# Altium schematic sheet STM32.SchDoc: STM32
size A3; DocumentNumber: 11; Revision: 2.0; SheetNumber: 11; SheetTotal: 18
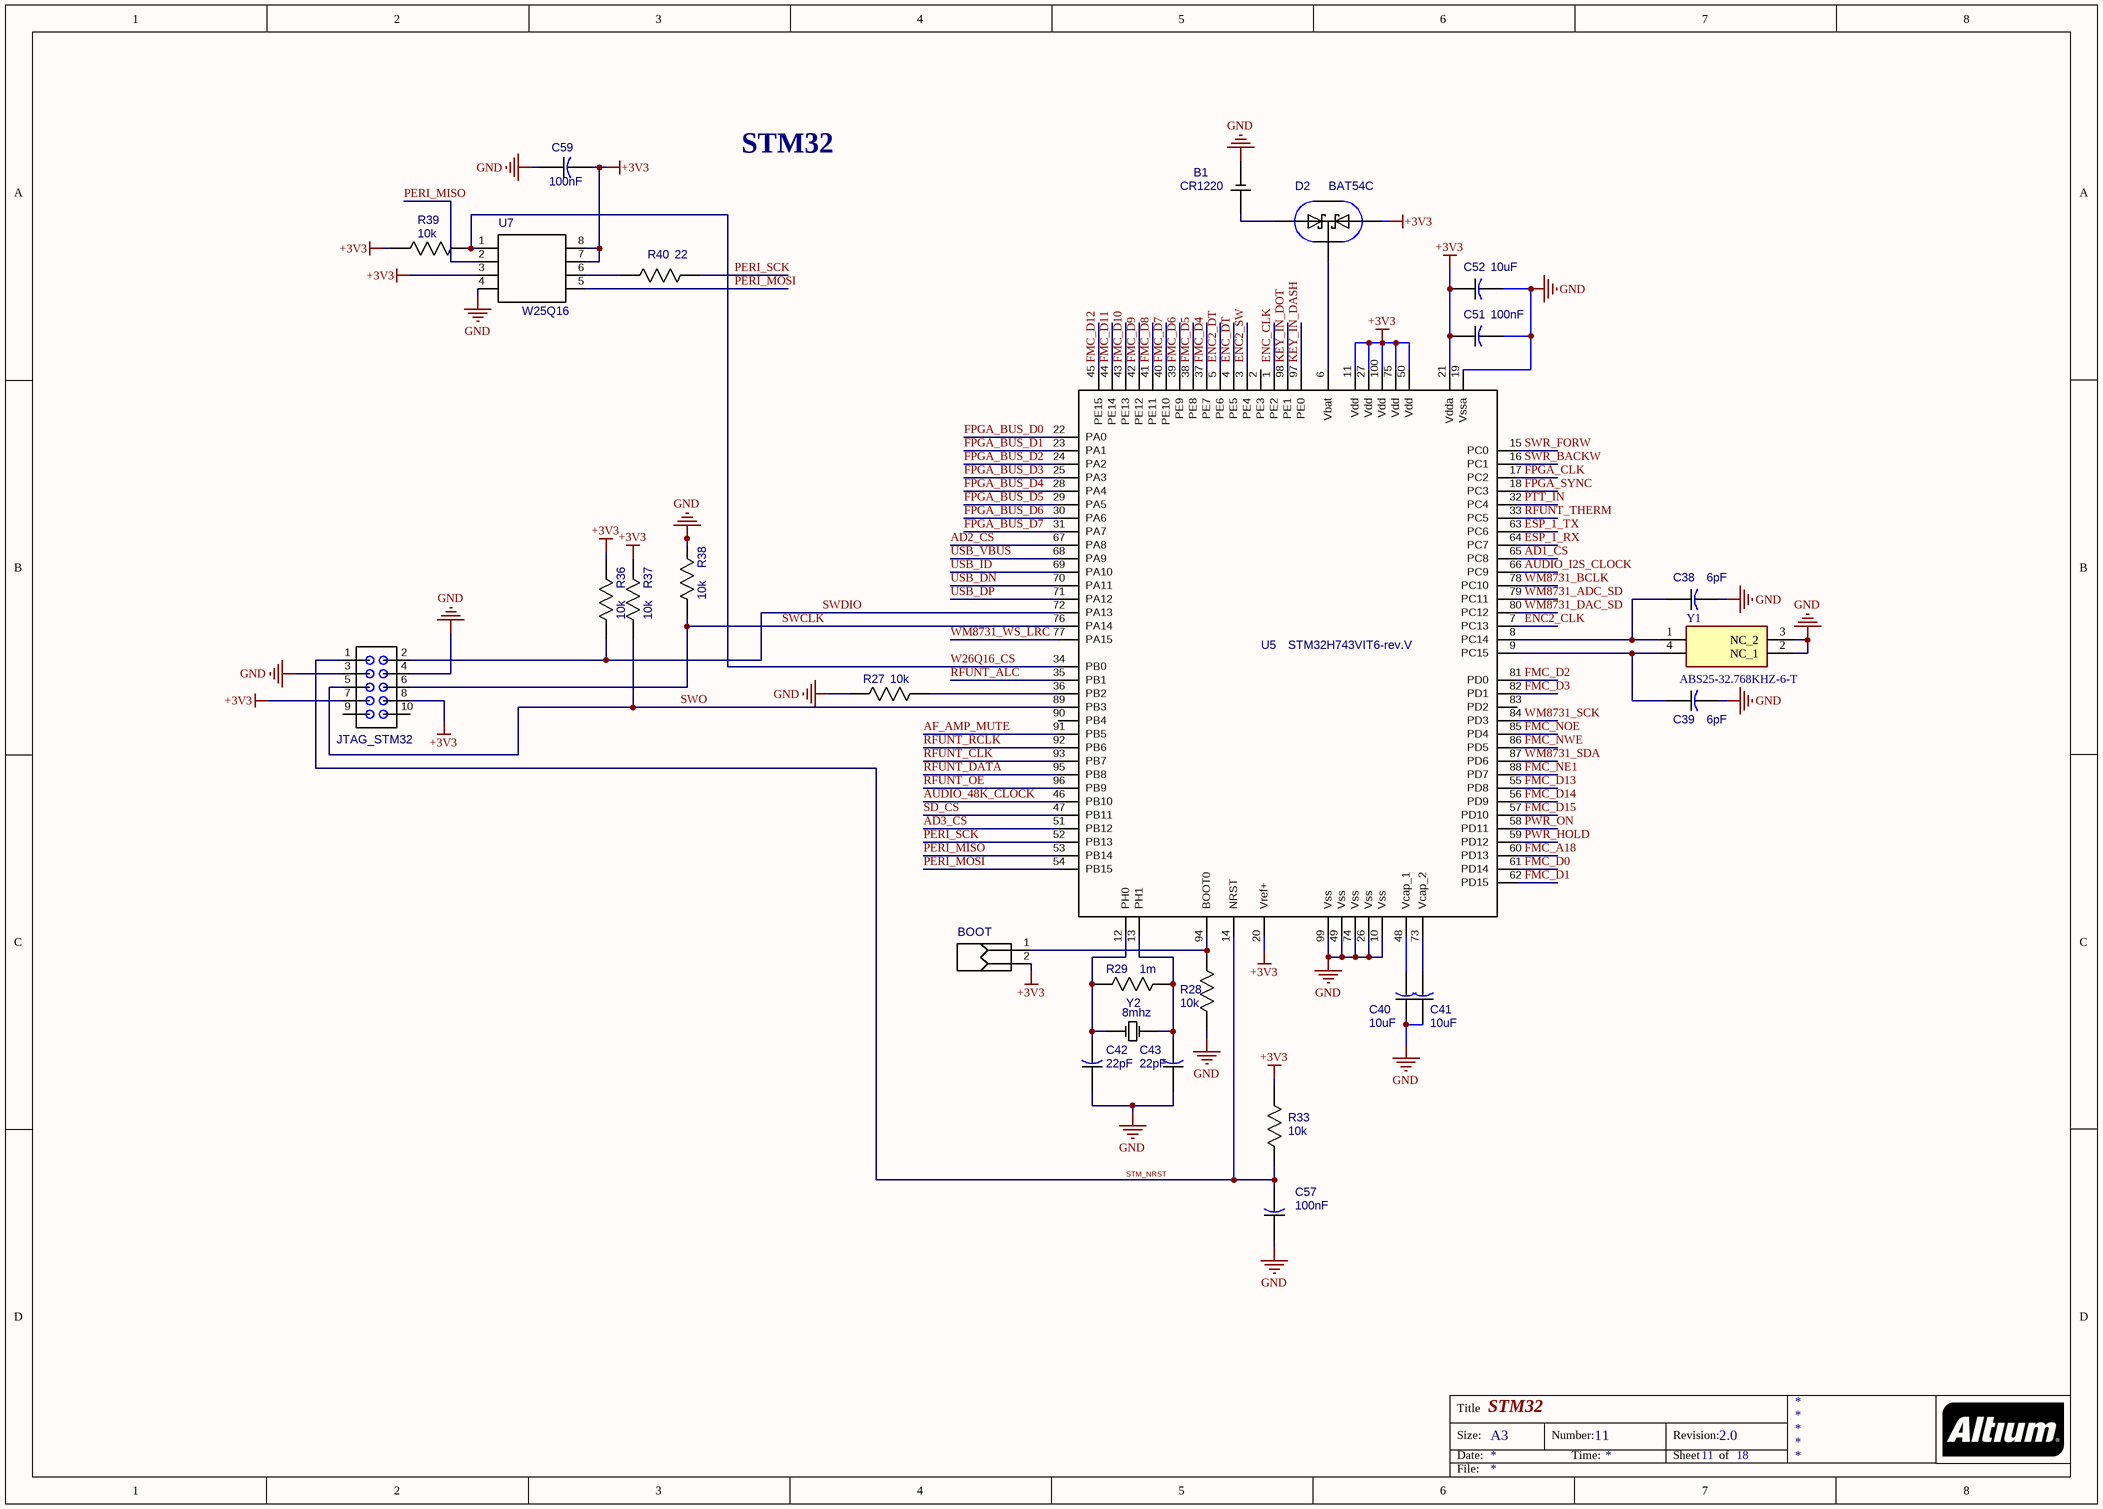
[diagram p0: STM32.SchDoc]

## Parts
B1  CR1220  [KLS5-CR1220-01]
BOOT  (no value)  [51022-0200]
C38  6pF  [CAP_0805]
C39  6pF  [CAP_0805]
C40  10uF  [CAP_0805]
C41  10uF  [CAP_0805]
C42  22pF  [CAP_0805]
C43  22pF  [CAP_0805]
C51  100nF  [CAP_0805]
C52  10uF  [CAP_0805]
C57  100nF  [CAP_0805]
C59  100nF  [CAP_0805]
D2  BAT54C  [BAT54C]
JTAG_STM32  (no value)  [IDC10]
R27  10k  [RES_0805]
R28  10k  [RES_0805]
R29  1m  [RES_0805]
R33  10k  [RES_0805]
R36  10k  [RES_0805]
R37  10k  [RES_0805]
R38  10k  [RES_0805]
R39  10k  [RES_0805]
R40  22  [RES_0805]
U5  STM32H743VIT6-rev.V  [STM32H743VIT6]
U7  W25Q16  [W25Q16]
Y1  ABS25-32.768KHZ-6-T  [ABS25]
Y2  8mhz  [ECS-200-20-1]

## Nets
+3V3: BOOT.2 C51.1 C52.1 C59.2 D2.1((A1)) JTAG_STM32.7 JTAG_STM32.8 R33.2 R36.1 R37.1 R39.1 U5.11(Vdd) U5.20(Vref+) U5.21(Vdda) U5.27(Vdd) U5.50(Vdd) U5.75(Vdd) U5.100(Vdd) U7.3(WP) U7.7(HOLD) U7.8(VCC)
GND: B1.2(NEG) C38.2 C39.2 C40.1 C41.1 C42.1 C43.1 C51.2 C52.2 C57.1 C59.1 JTAG_STM32.3 JTAG_STM32.4 R27.1 R28.1 R38.1 U5.10(Vss) U5.19(Vssa) U5.26(Vss) U5.49(Vss) U5.74(Vss) U5.99(Vss) U7.4(GND) Y1.2(NC_1) Y1.3(NC_2)
AD1_CS: U5.65(PC8)
AD2_CS: U5.67(PA8)
AD3_CS: U5.51(PB12)
AF_AMP_MUTE: U5.91(PB5)
AUDIO_48K_CLOCK: U5.46(PB10)
AUDIO_I2S_CLOCK: U5.66(PC9)
ENC2_CLK: U5.7(PC13)
ENC2_DT: U5.5(PE6)
ENC2_SW: U5.3(PE4)
ENC_CLK: U5.1(PE2)
ENC_DT: U5.4(PE5)
ESP_1_RX: U5.64(PC7)
ESP_1_TX: U5.63(PC6)
FMC_A18: U5.60(PD13)
FMC_D0: U5.61(PD14)
FMC_D1: U5.62(PD15)
FMC_D2: U5.81(PD0)
FMC_D3: U5.82(PD1)
FMC_D4: U5.37(PE7)
FMC_D5: U5.38(PE8)
FMC_D6: U5.39(PE9)
FMC_D7: U5.40(PE10)
FMC_D8: U5.41(PE11)
FMC_D9: U5.42(PE12)
FMC_D10: U5.43(PE13)
FMC_D11: U5.44(PE14)
FMC_D12: U5.45(PE15)
FMC_D13: U5.55(PD8)
FMC_D14: U5.56(PD9)
FMC_D15: U5.57(PD10)
FMC_NE1: U5.88(PD7)
FMC_NOE: U5.85(PD4)
FMC_NWE: U5.86(PD5)
FPGA_BUS_D0: U5.22(PA0)
FPGA_BUS_D1: U5.23(PA1)
FPGA_BUS_D2: U5.24(PA2)
FPGA_BUS_D3: U5.25(PA3)
FPGA_BUS_D4: U5.28(PA4)
FPGA_BUS_D5: U5.29(PA5)
FPGA_BUS_D6: U5.30(PA6)
FPGA_BUS_D7: U5.31(PA7)
FPGA_CLK: U5.17(PC2)
FPGA_SYNC: U5.18(PC3)
KEY_IN_DASH: U5.97(PE0)
KEY_IN_DOT: U5.98(PE1)
PERI_MISO: U5.53(PB14) U7.2(SO)
PERI_MOSI: U5.54(PB15) U7.5(SI)
PERI_SCK: R40.2 U5.52(PB13)
PTT_IN: U5.32(PC4)
PWR_HOLD: U5.59(PD12)
PWR_ON: U5.58(PD11)
RFUNT_ALC: U5.35(PB1)
RFUNT_CLK: U5.93(PB7)
RFUNT_DATA: U5.95(PB8)
RFUNT_OE: U5.96(PB9)
RFUNT_RCLK: U5.92(PB6)
RFUNT_THERM: U5.33(PC5)
SD_CS: U5.47(PB11)
STM_NRST: C57.2 JTAG_STM32.1 R33.1 U5.14(NRST)
SWCLK: JTAG_STM32.6 R38.2 U5.76(PA14)
SWDIO: JTAG_STM32.2 R36.2 U5.72(PA13)
SWO: JTAG_STM32.5 R37.2 U5.89(PB3)
SWR_BACKW: U5.16(PC1)
SWR_FORW: U5.15(PC0)
USB_DN: U5.70(PA11)
USB_DP: U5.71(PA12)
USB_ID: U5.69(PA10)
USB_VBUS: U5.68(PA9)
W26Q16_CS: R39.2 U5.34(PB0) U7.1(CS)
WM8731_ADC_SD: U5.79(PC11)
WM8731_BCLK: U5.78(PC10)
WM8731_DAC_SD: U5.80(PC12)
WM8731_SCK: U5.84(PD3)
WM8731_SDA: U5.87(PD6)
WM8731_WS_LRC: U5.77(PA15)
NetB1_1: B1.1(POS) D2.2((A2))
NetBOOT_1: BOOT.1 R28.2 U5.94(BOOT0)
NetC38_1: C38.1 U5.8(PC14) Y1.1
NetC39_1: C39.1 U5.9(PC15) Y1.4
NetC40_2: C40.2 U5.48(Vcap_1)
NetC41_2: C41.2 U5.73(Vcap_2)
NetC42_2: C42.2 R29.1 U5.12(PH0) Y2.1(OSC1)
NetC43_2: C43.2 R29.2 U5.13(PH1) Y2.2(OSC2)
NetD2_3: D2.3((K1),(K2)) U5.6(Vbat)
NetR27_2: R27.2 U5.36(PB2)
NetR40_1: R40.1 U7.6(CLK)

Not connected (* = marked no-connect by the designer): JTAG_STM32 9 10; U5 2(PE3) 83(PD2) 90(PB4)

## Notes on the sheet
- STM32
- Title
- Size:
- Date:
- A3
- Number:
- Time:
- Revision:
- Sheet
- of
- File:

## Library data of the parts
B1 = BR1632A/FA: Value: CR1220
BOOT = 51022-0200: 2 Pin
C38-C43 C51 C52 C57 C59 = CAP_0805
  C40 C41 C52: Value: 10uF
  C42 C43: Value: 22pF
  C51 C57 C59: Value: 100nF
JTAG_STM32 = IDC10: 2*5 Pin
R27-R29 R33 R36-R40 = RES_0805
  R27 R28 R33 R36-R39: Value: 10k
  R29: Value: 1m
  R40: Value: 22
U5 = STM32H743VIT6: Value: STM32H743VIT6-rev.V
Y1 = ABS25-32.768KHZ-6-T: Crystal or Oscillator; Manufacturer_Name: ABRACON; Datasheet Link: http://www.abracon.com/Resonators/abs25.pdf; Manufacturer_Part_Number: ABS25-32.768KHZ-6-T; Mouser Part Number: 815-ABS25-32.768K6-T; Mouser Price/Stock: https://www.mouser.co.uk/ProductDetail/ABRACON/ABS25-32768KHZ-6-T?qs=wl%2FhatdkTudHMJeSjMoOzg%3D%3D; RS Part Number: 1712795P; RS Price/Stock: http://uk.rs-online.com/web/p/products/1712795P
Y2 = ECS-200-20-1: Value: 8mhz
D2 = BAT54C: Value: BAT54C
U7 = W25Q16: Value: W25Q16